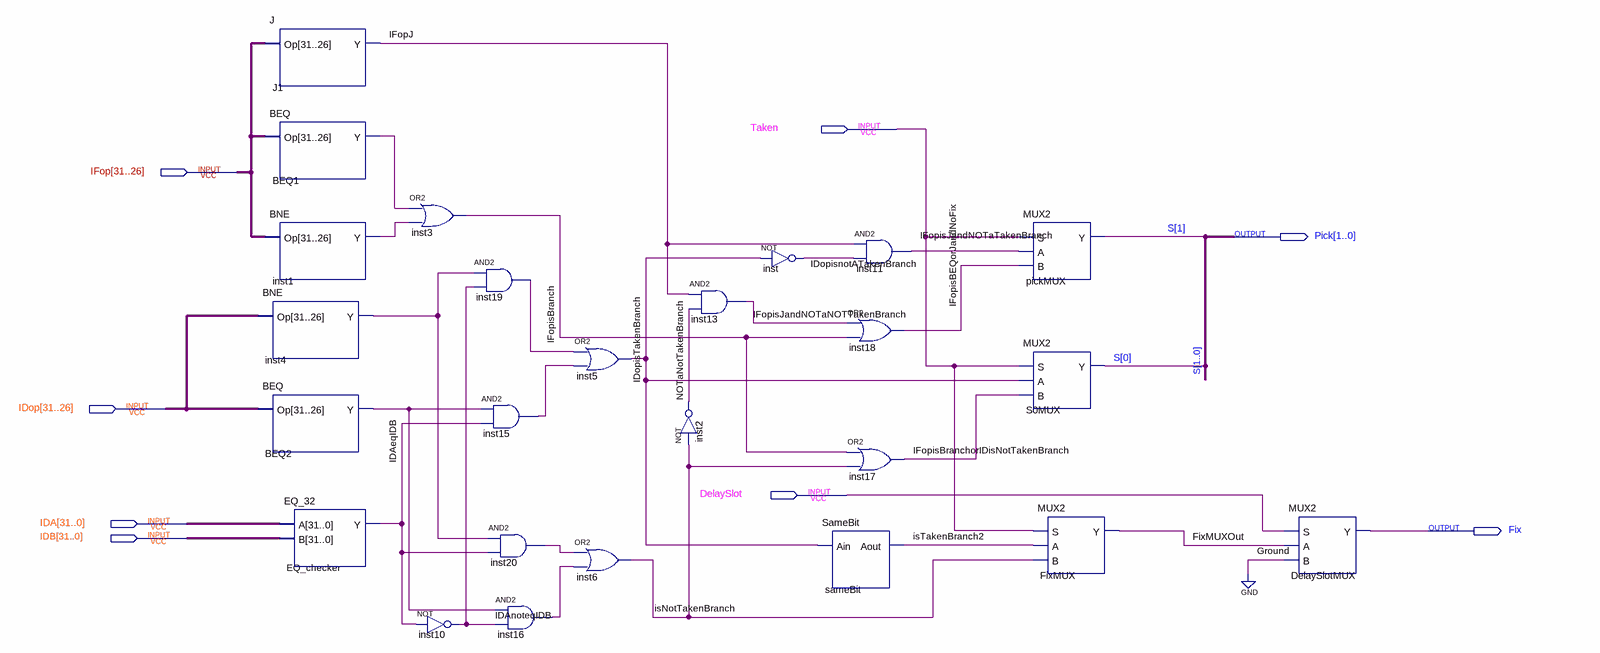
[diagram p0: schematic sheet]
// Quartus schematic Branch_Prediction.bdf as structural Verilog: 25 symbols, 8 pins
module Branch_Prediction (
  input  Taken,
  input  [31:26] IFop,
  input  [31:26] IDop,
  input  DelaySlot,
  input  [31:0] IDA,
  input  [31:0] IDB,
  output [1:0] Pick,
  output Fix
);

  wire BEQ1_y, BEQ2_y, FixMUXOut, IDAeqIDB, IDAnoteqIDB, IDopisnotATakenBranch, IDopisTakenBranch,
       IFopisBEQorJandNoFix, IFopisBranch, IFopisBranchorIDisNotTakenBranch, IFopisJandNOTaNOTTakenBranch,
       IFopisJandNOTaTakenBranch, IFopJ, inst1_y, inst4_y, inst15_out, inst16_out, inst19_out, inst20_out,
       isNotTakenBranch, isTakenBranch2, NOTaNotTakenBranch;

  J J1 (.Op(IFop), .Y(IFopJ));
  BEQ BEQ1 (.Op(IFop), .Y(BEQ1_y));
  BNE inst1 (.Op(IFop), .Y(inst1_y));
  BNE inst4 (.Op(IDop), .Y(inst4_y));
  BEQ BEQ2 (.Op(IDop), .Y(BEQ2_y));
  EQ_32 EQ_checker (.A(IDA), .B(IDB), .Y(IDAeqIDB));
  or inst3 (IFopisBranch, BEQ1_y, inst1_y);
  not inst10 (IDAnoteqIDB, IDAeqIDB);
  and inst19 (inst19_out, inst4_y, IDAnoteqIDB);
  and inst15 (inst15_out, BEQ2_y, IDAeqIDB);
  and inst20 (inst20_out, inst4_y, IDAeqIDB);
  and inst16 (inst16_out, BEQ2_y, IDAnoteqIDB);
  or inst5 (IDopisTakenBranch, inst19_out, inst15_out);
  or inst6 (isNotTakenBranch, inst20_out, inst16_out);
  not inst2 (NOTaNotTakenBranch, isNotTakenBranch);
  and inst13 (IFopisJandNOTaNOTTakenBranch, IFopJ, NOTaNotTakenBranch);
  not inst (IDopisnotATakenBranch, IDopisTakenBranch);
  or inst18 (IFopisBEQorJandNoFix, IFopisJandNOTaNOTTakenBranch, IFopisBranch);
  or inst17 (IFopisBranchorIDisNotTakenBranch, IFopisBranch, isNotTakenBranch);
  SameBit sameBit (.Ain(IDopisTakenBranch), .Aout(isTakenBranch2));
  and inst11 (IFopisJandNOTaTakenBranch, IFopJ, IDopisnotATakenBranch);
  MUX2 pickMUX (.S(Taken), .A(IFopisJandNOTaTakenBranch), .B(IFopisBEQorJandNoFix), .Y(Pick[1]));
  MUX2 S0MUX (.S(Taken), .A(IDopisTakenBranch), .B(IFopisBranchorIDisNotTakenBranch), .Y(Pick[0]));
  MUX2 FixMUX (.S(Taken), .A(isTakenBranch2), .B(isNotTakenBranch), .Y(FixMUXOut));
  MUX2 DelaySlotMUX (.S(DelaySlot), .A(FixMUXOut), .B(1'b0), .Y(Fix));

  // Other names for the same wires on the sheet: S[1:0] = Pick
endmodule
